# EAGLE design RFID_Lock_System (EAGLE 8.3.2)
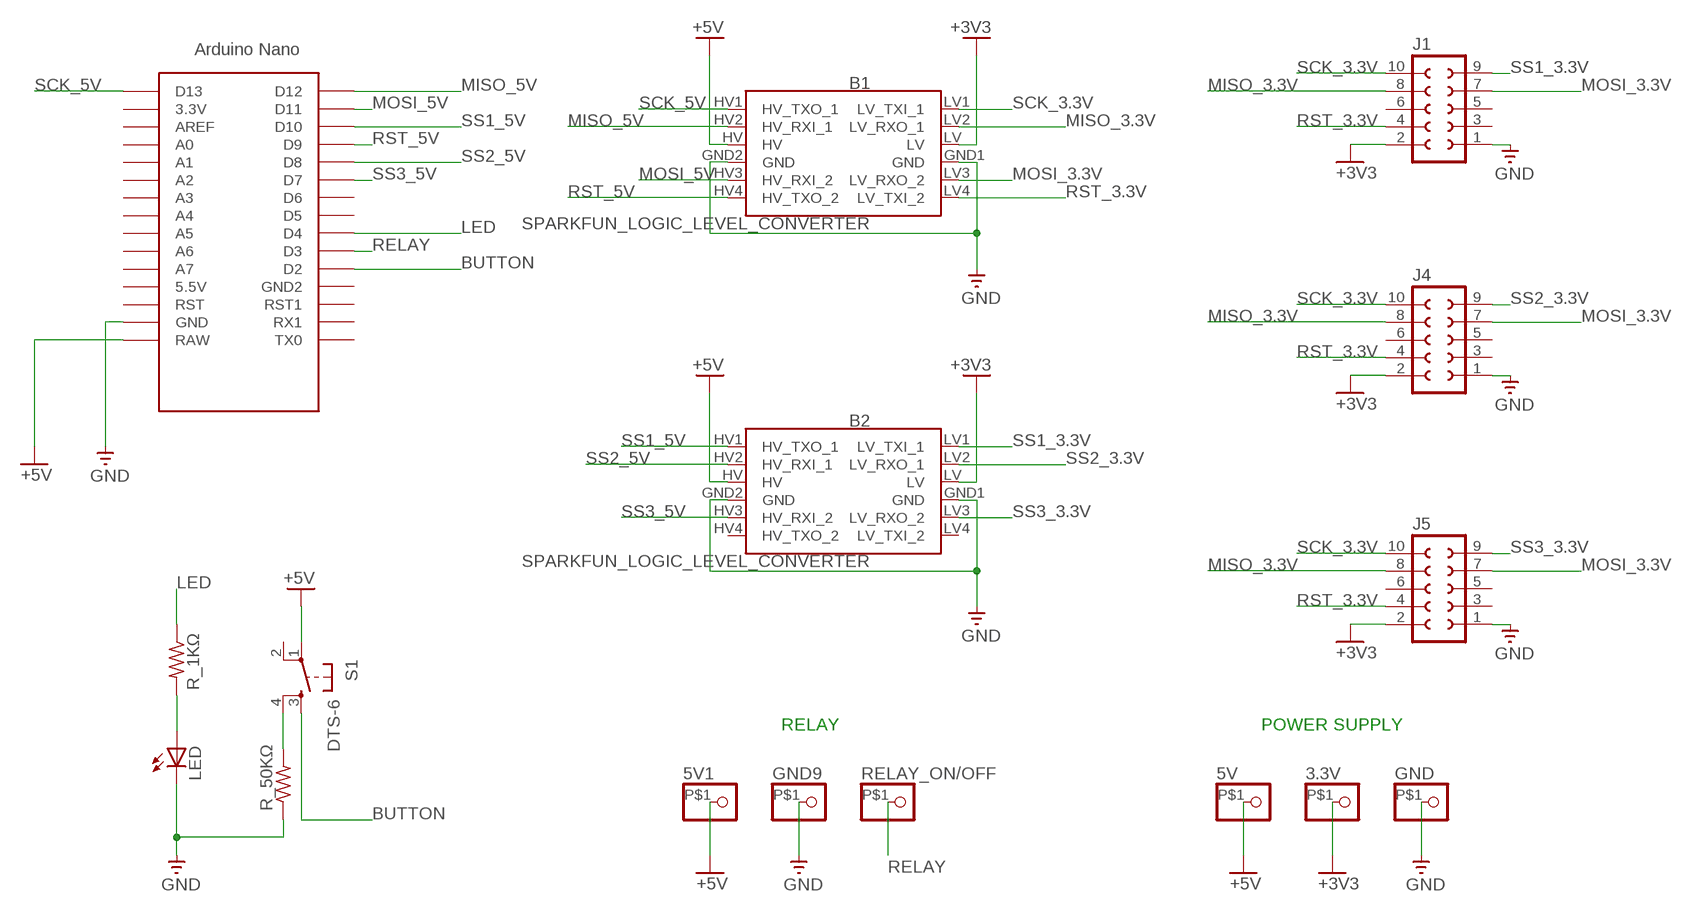
[diagram p0: schematic, sheet 1]

## Parts
3.3V  PINHD-1X1-BIGPOGO  [1X1-BIGPOGO]
5V  PINHD-1X1-BIGPOGO  [1X1-BIGPOGO]
5V1  PINHD-1X1-BIGPOGO  [1X1-BIGPOGO]
B1  SPARKFUN_LOGIC_LEVEL_CONVERTER  [SPARKFUN_LOGIC_LEVEL_CONVERTER]
B2  SPARKFUN_LOGIC_LEVEL_CONVERTER  [SPARKFUN_LOGIC_LEVEL_CONVERTER]
GND  PINHD-1X1-BIGPOGO  [1X1-BIGPOGO]
GND9  PINHD-1X1-BIGPOGO  [1X1-BIGPOGO]
J1  SOCKET-10V  [S10V]
J4  SOCKET-10V  [S10V]
J5  SOCKET-10V  [S10V]
LED  LED5MM  [LED5MM]
R_1KΩ  R-US_0204/7  [0204/7]
R_50KΩ  R-US_0204/7  [0204/7]
RELAY_ON/OFF  PINHD-1X1-BIGPOGO  [1X1-BIGPOGO]
S1  DTS-6  [DTS-6]
U$1  NANO  [NANO]

## Nets
+3V3: 3.3V.P$1 B1.LV B2.LV J1.2 J4.2 J5.2
+5V: 5V1.P$1 5V.P$1 B1.HV B2.HV S1.1 U$1.RAW
BUTTON: S1.3 U$1.D2
GND: B1.GND1(GND) B1.GND2(GND) B2.GND1(GND) B2.GND2(GND) GND9.P$1 GND.P$1 J1.1 J4.1 J5.1 LED.K(C) R_50KΩ.1 U$1.GND
LED: R_1KΩ.1 U$1.D4
MISO_3.3V: B1.LV2(LV_RXO_1) J1.8 J4.8 J5.8
MISO_5V: B1.HV2(HV_RXI_1) U$1.D12
MOSI_3.3V: B1.LV3(LV_RXO_2) J1.7 J4.7 J5.7
MOSI_5V: B1.HV3(HV_RXI_2) U$1.D11
N$1: LED.A R_1KΩ.2
N$2: R_50KΩ.2 S1.4
RELAY: RELAY_ON/OFF.P$1 U$1.D3
RST_3.3V: B1.LV4(LV_TXI_2) J1.4 J4.4 J5.4
RST_5V: B1.HV4(HV_TXO_2) U$1.D9
SCK_3.3V: B1.LV1(LV_TXI_1) J1.10 J4.10 J5.10
SCK_5V: B1.HV1(HV_TXO_1) U$1.D13
SS1_3.3V: B2.LV1(LV_TXI_1) J1.9
SS1_5V: B2.HV1(HV_TXO_1) U$1.D10
SS2_3.3V: B2.LV2(LV_RXO_1) J4.9
SS2_5V: B2.HV2(HV_RXI_1) U$1.D8
SS3_3.3V: B2.LV3(LV_RXO_2) J5.9
SS3_5V: B2.HV3(HV_RXI_2) U$1.D7
Unconnected: B2.HV4(HV_TXO_2) B2.LV4(LV_TXI_2) J1.3 J1.5 J1.6 J4.3 J4.5 J4.6 J5.3 J5.5 J5.6 S1.2 U$1.3.3V U$1.5V(5.5V) U$1.A0 U$1.A1 U$1.A2 U$1.A3 U$1.A4 U$1.A5 U$1.A6 U$1.A7 U$1.AREF U$1.D5 U$1.D6 U$1.GND1(GND2) U$1.ICSP1 U$1.ICSP2 U$1.ICSP3 U$1.ICSP4 U$1.ICSP5 U$1.ICSP6 U$1.RST U$1.RST1 U$1.RX1 U$1.TX0

## Notes on the sheet
- RELAY | POWER SUPPLY

## Library data of the parts
3.3V 5V 5V1 GND GND9 RELAY_ON/OFF = adafruit:PINHD-1X1: Pin header 1x1 for 0.1" spacing With round pins; OC_NEWARK: unknown
B1 B2 = SparkFun-Boards:SPARKFUN_LOGIC_LEVEL_CONVERTER: SparkFun Logic Level Converter -Bi-Directional This is the mechnical outline for the 3.3V - 5V bi directional logic level converter. *Note, the "LOCK" Package has the header pins staggered by an offset of 5 mils (off center line), so that when you slide a row of standard 0.1" headers into the PTH pads, it will hold position vertically. See the follwing turorial for more information on this type of special footprints: Sneaky Footprints <https://www.sparkfun.com/tutorials/114> SparkFun Products: SparkFun Logic Level Converter - Bi-Directional <https://www.sparkfun.com/products/12009>; OC_NEWARK: unknown
J1 J4 J5 = con-3m-skt-header:SOCKET-10: 10 pin PCB Socket (3m 85xx/51xx); OC_NEWARK: unknown
LED = adafruit:LED: LED OSRAM: - CHIPLED LG R971, LG N971, LY N971, LG Q971, LY Q971, LO R971, LY R971 LH N974, LH R974 LS Q976, LO Q976, LY Q976 LO Q996 - Hyper CHIPLED LW Q18S LB Q993, LB Q99A, LB R99A - SideLED LS A670, LO A670, LY A670, LG A670, LP A670 LB A673, LV A673, LT A673, LW A673 LH A674 LY A675 LS A676, LA A676, LO A676, LY A676, LW A676 LS A679, LY A679, LG A679 - Hyper Micro SIDELED® LS Y876, LA Y876, LO Y876, LY Y876 LT Y87S - SmartLED LW L88C, LW L88S LB L89C, LB L89S, LG L890 LS L89K, LO L89K, LY L89K LS L896, LA L896, LO L896, LY L896 - TOPLED LS T670, LO T670, LY T670, LG T670, LP T670 LSG T670, LSP T670, LSY T670, LOP T670, LYG T670 LG T671, LOG T671, LSG T671 LB T673, LV T673, LT T673, LW T673 LH T674 LS T676, LA T676, LO T676, LY T676, LB T676, LH T676, LSB T676, LW T676 LB T67C, LV T67C, LT T67C, LS T67K, LO T67K, LY T67K, LW E67C LS E67B, LA E67B, LO E67B, LY E67B, LB E67C, LV E67C, LT E67C LW T67C LS T679, LY T679, LG T679 LS T770, LO T770, LY T770, LG T770, LP T770 LB T773, LV T773, LT T773, LW T773 LH T774 LS E675, LA E675, LY E675, LS T675 LS T776, LA T776, LO T776, LY T776, LB T776 LHGB T686 LT T68C, LB T68C - Hyper Mini TOPLED® LB M676 - Mini TOPLED Santana® LG M470 LS M47K, LO M47K, LY M47K Source: http://www.osram.convergy.de/; OC_NEWARK: unknown
R_1KΩ R_50KΩ = resistor:R-US_: RESISTOR, American symbol; OC_NEWARK: unknown
S1 = switch-tact:DTS-6; MPN: MC32829; OC_NEWARK: 67P3614
U$1 = Arduino-clone:NANO: Arduino Nano; OC_NEWARK: unknown

## Net classes
0 default: width 0.305 mm, drill 0.762 mm, clearance 0.508 mm

## Board
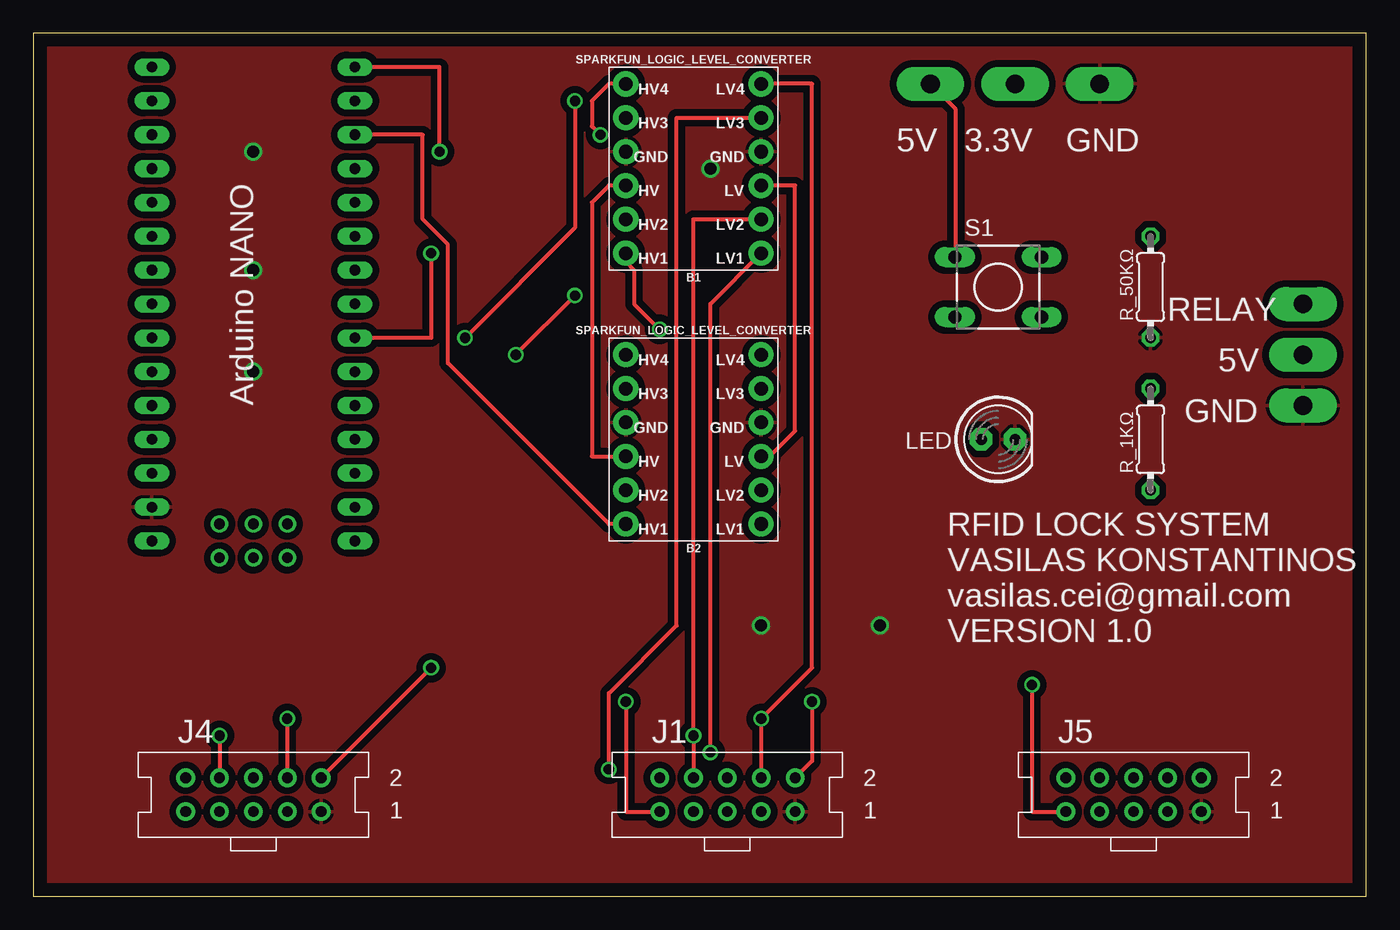
[diagram p1: board, top side]
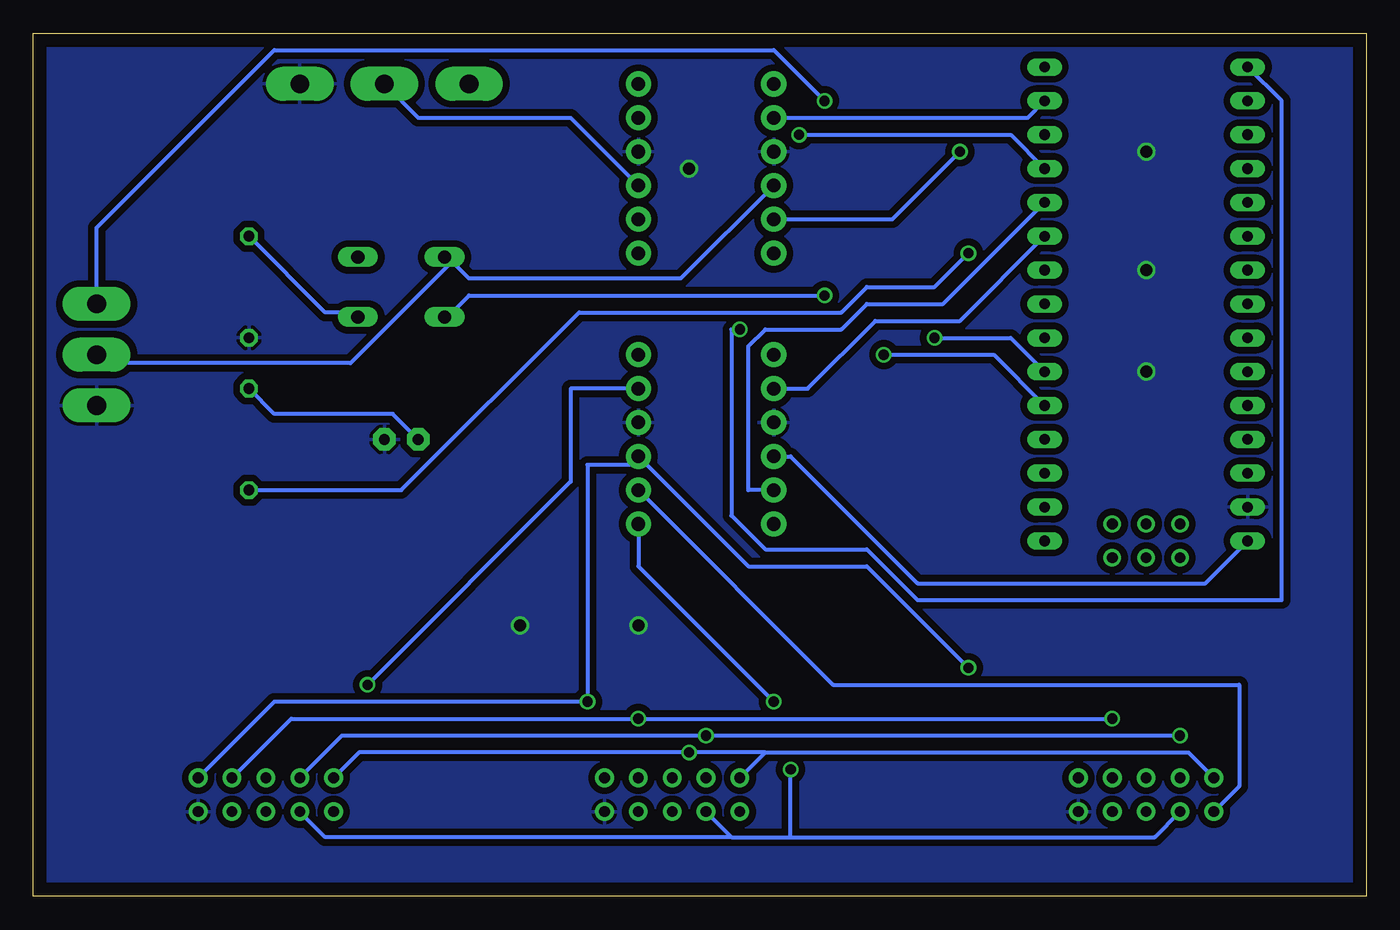
[diagram p2: board, bottom side, seen from below]

Size 100 x 64.76 mm. Coordinates in mm from the lower left corner, seen from the top.
Outline: 0,0 100,0 100,64.76 0,64.76 0,0
Copper layers (1*16): Top 0.035mm / dielectric 1.5mm / Bottom 0.035mm
Design rules "default": minimum track width 6mil, minimum drill 0.35mm, track to track 6mil, track to pad 6mil, pad to pad 6mil, via to via 6mil, smd to smd 6mil, copper to edge 40mil, drill to drill 6mil, minimum pad ring 10mil, minimum via ring 8mil, stop-mask expansion 4mil, vias tented up to drill 0mil, thermal gap 10mil

### Footprints (pad centres in the part's own frame; a part is rotated, then mirrored left to right if it is on the bottom)
1X1-BIGPOGO = drill 1.4 pad 2.54 long: P$1 0,0
SPARKFUN_LOGIC_LEVEL_CONVERTER = drill 1.016 pad 1.88: GND1 -5.08,-1.27; GND2 5.08,-1.27; HV 5.08,1.27; HV1 5.08,6.35; HV2 5.08,3.81; HV3 5.08,-3.81; HV4 5.08,-6.35; LV -5.08,1.27; LV1 -5.08,6.35; LV2 -5.08,3.81; LV3 -5.08,-3.81; LV4 -5.08,-6.35
S10V = drill 0.8 pad 1.4: 1 5.08,-1.27; 2 5.08,1.27; 3 2.54,-1.27; 4 2.54,1.27; 5 0,-1.27; 6 0,1.27; 7 -2.54,-1.27; 8 -2.54,1.27; 9 -5.08,-1.27; 10 -5.08,1.27
LED5MM = drill 0.813 pad 1.676 octagon: A -1.27,0; K 1.27,0
0204/7 = drill 0.813 octagon: 1 -3.81,0; 2 3.81,0
DTS-6 = drill 1 long: 1 -3.25,2.25; 2 3.25,2.25; 3 -3.25,-2.25; 4 3.25,-2.25
NANO = drill 0.8 long: 3.3V -10.16,24.13; 5V -10.16,-1.27; A0 -10.16,19.05; A1 -10.16,16.51; A2 -10.16,13.97; A3 -10.16,11.43; A4 -10.16,8.89; A5 -10.16,6.35; A6 -10.16,3.81; A7 -10.16,1.27; AREF -10.16,21.59; D2 5.08,1.27; D3 5.08,3.81; D4 5.08,6.35; D5 5.08,8.89; D6 5.08,11.43; D7 5.08,13.97; D8 5.08,16.51; D9 5.08,19.05; D10 5.08,21.59; D11 5.08,24.13; D12 5.08,26.67; D13 -10.16,26.67; GND -10.16,-6.35; GND1 5.08,-1.27; RAW -10.16,-8.89; RST -10.16,-3.81; RST1 5.08,-3.81; RX1 5.08,-6.35; TX0 5.08,-8.89 | drill 0.8: ICSP1 -5.08,-10.16; ICSP2 -5.08,-7.62; ICSP3 -2.54,-10.16; ICSP4 -2.54,-7.62; ICSP5 0,-10.16; ICSP6 0,-7.62

### Placement (x,y rotation side)
3.3V  73.66,60.96 0 top
5V  95.25,40.64 0 top
5V1  67.31,60.96 0 top
B1  49.53,54.61 180 top
B2  49.53,34.29 180 top
GND  95.25,36.83 0 top
GND9  80.01,60.96 0 top
J1  52.07,7.62 0 top
J4  16.51,7.62 0 top
J5  82.55,7.62 0 top
LED  72.39,34.29 0 top
R_1KΩ  83.82,34.29 90 top
R_50KΩ  83.82,45.72 90 top
RELAY_ON/OFF  95.25,44.45 0 top
S1  72.39,45.72 0 top
U$1  19.05,35.56 0 top

### Tracks (layer width: path | path; a pad name or v marks a point on that pad's centre or on a via)
+3V3  (via drill 0.76)
  Top 0.305: v29.84,17.14 J4.2 | J1.2 58.42,10.16 v58.42,14.6 | B1.LV 57.15,53.34 57.15,34.92 55.24,33.02 B2.LV
  Bottom 0.305: B1.LV 59.69,58.42 71.12,58.42 3.3V.P$1 | v29.84,17.14 37.47,24.77 46.35,24.77 53.98,32.38 | 53.98,32.38 58.42,32.38 v58.42,14.6 81.92,14.6 J5.2 | 53.98,32.38 B2.LV
+5V
  Top 0.305: 5V1.P$1 69.22,59.05 69.22,48.26 S1.1 | B2.HV 41.91,33.02 41.91,52.07 43.18,53.34 B1.HV
  Bottom 0.305: U$1.RAW 12.06,23.49 33.66,23.49 43.18,33.02 B2.HV | 68.58,47.62 67.31,46.35 51.44,46.35 B1.HV | 5V.P$1 94.61,40 76.2,40 68.58,47.62 | 68.58,47.62 S1.1
BUTTON  (via drill 0.76)
  Top 0.305: v40.64,45.09 v36.2,40.64
  Bottom 0.305: U$1.D2 27.94,40.64 v36.2,40.64 | v40.64,45.09 67.31,45.09 68.58,43.81 S1.3
GND  (via drill 0.9)
  other vias: 50.8,54.61 54.61,20.32 63.5,20.32 16.51,55.88 16.51,46.99 16.51,39.37
  pour Top: -1.27,66.04 -1.27,-1.27 101.6,-1.27 101.6,66.04
  pour Bottom: -2.54,67.31 -2.54,-2.54 102.87,-2.54 102.87,67.31
LED  (via drill 0.76)
  Top 0.305: U$1.D4 29.84,41.91 v29.84,48.26
  Bottom 0.305: v29.84,48.26 32.38,45.72 37.47,45.72 39.37,43.81 59.05,43.81 72.39,30.48 R_1KΩ.1
MISO_3.3V  (via drill 0.76)
  Top 0.305: v13.97,12.06 J4.8 | J1.8 v49.53,12.06 49.53,50.8 B1.LV2
  Bottom 0.305: v13.97,12.06 v49.53,12.06 76.83,12.06 J5.8
MISO_5V  (via drill 0.76)
  Top 0.305: U$1.D12 30.48,62.23 v30.48,55.88
  Bottom 0.305: v30.48,55.88 35.56,50.8 B1.HV2
MOSI_3.3V  (via drill 0.76)
  Top 0.305: B1.LV3 48.26,58.42 48.26,20.32 43.18,15.24 v43.18,9.53
  Bottom 0.305: J4.7 15.88,4.44 43.18,4.44 | 47.62,4.44 43.18,4.44 | J1.7 47.62,4.44 | J5.7 78.11,4.44 47.62,4.44 | 43.18,4.44 v43.18,9.53
MOSI_5V
  Bottom 0.305: U$1.D11 25.4,58.42 B1.HV3
N$1
  Bottom 0.305: R_1KΩ.2 81.92,36.2 73.03,36.2 LED.A
N$2
  Bottom 0.305: R_50KΩ.2 78.11,43.81 76.2,43.81 S1.4
RELAY  (via drill 0.76)
  Top 0.305: v32.38,41.91 40.64,50.16 v40.64,59.69
  Bottom 0.305: U$1.D3 26.67,41.91 v32.38,41.91 | v40.64,59.69 44.45,63.5 81.92,63.5 95.25,50.16 RELAY_ON/OFF.P$1
RST_3.3V  (via drill 0.76)
  Top 0.305: v19.05,13.33 J4.4 | J1.4 v54.61,13.33 58.42,17.14 58.42,60.96 B1.LV4
  Bottom 0.305: v19.05,13.33 v54.61,13.33 80.64,13.33 J5.4
RST_5V  (via drill 0.76)
  Top 0.305: v42.55,57.15 41.91,57.79 41.91,59.69 43.18,60.96 B1.HV4
  Bottom 0.305: U$1.D9 26.67,57.15 v42.55,57.15
SCK_3.3V  (via drill 0.76)
  Top 0.305: B1.LV1 50.8,44.45 v50.8,10.79
  Bottom 0.305: J4.10 13.34,10.79 45.09,10.79 | J1.10 45.09,10.79 | J5.10 75.56,10.79 v50.8,10.79 45.09,10.79
SCK_5V  (via drill 0.76)
  Top 0.305: v46.99,42.54 45.09,44.45 45.09,46.99 44.45,47.62 B1.HV1
  Bottom 0.305: U$1.D13 6.35,59.69 6.35,22.23 33.66,22.23 37.47,26.03 45.09,26.03 47.62,28.57 47.62,42.54 v46.99,42.54
SS1_3.3V  (via drill 0.76)
  Top 0.305: J1.9 44.45,6.35 v44.45,14.6
  Bottom 0.305: v44.45,14.6 54.61,24.77 B2.LV1
SS1_5V
  Top 0.305: U$1.D10 29.21,57.15 29.21,50.8 31.11,48.9 31.11,40 43.18,27.94 B2.HV1
SS2_3.3V
  Bottom 0.305: J4.9 9.53,8.26 9.53,15.87 40.01,15.87 B2.LV2
SS2_5V
  Bottom 0.305: U$1.D8 31.75,44.45 37.47,44.45 39.37,42.54 45.09,42.54 46.35,41.27 46.35,30.48 B2.HV2
SS3_3.3V  (via drill 0.76)
  Top 0.305: J5.9 74.93,6.35 v74.93,15.87
  Bottom 0.305: v74.93,15.87 59.69,31.11 59.69,38.1 B2.LV3
SS3_5V
  Bottom 0.305: U$1.D7 30.48,43.18 36.83,43.18 41.91,38.1 B2.HV3

### Text on the board
tPlace: 5V | 3.3V | GND | RELAY | 5V | Arduino NANO | GND | RFID LOCK SYSTEM / VASILAS KONSTANTINOS / vasilas.cei@gmail.com / VERSION 1.0